# Altium project Staj.PrjPcb
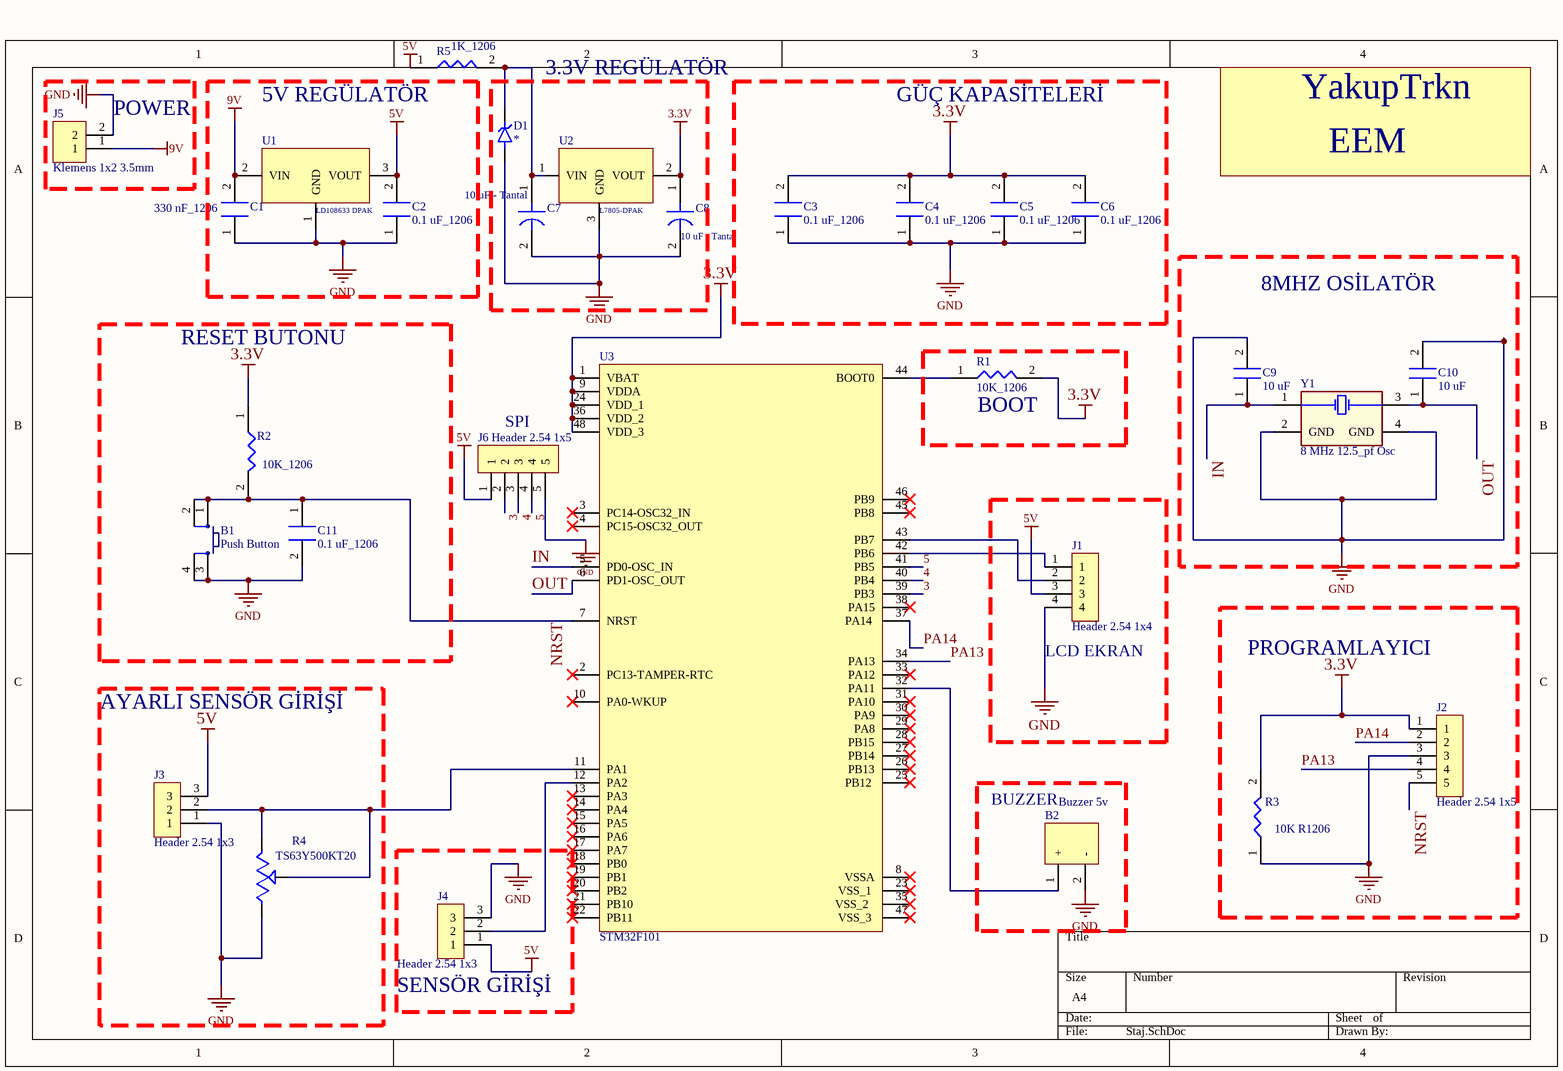
[diagram p0: Staj.SchDoc]
1 sheet, 30 parts. Net scope: global (net labels, ports and power ports of the same name join across sheets).
Board files: PCB2.PcbDoc, Staj.PcbDoc, PCB1.PcbDoc

## Sheet Staj.SchDoc
size A4

### Parts
?  (no value)
B1  Push Button  [PUSB BUTTON-SMD]
B2  Buzzer 5v  [Buzzer 5v]
C1  330 nF_1206  [C1206]
C2  0.1 uF_1206  [C1206]
C3  0.1 uF_1206  [C1206]
C4  0.1 uF_1206  [C1206]
C5  0.1 uF_1206  [C1206]
C6  0.1 uF_1206  [C1206]
C7  10 uF - Tantal  [C1206- TANTAL]
C8  10 uF - Tantal  [C1206- TANTAL]
C9  10 uF  [C1206]
C10  10 uF  [C1206]
C11  0.1 uF_1206  [C1206]
D1  *  [DIOM5436X247N]
J1  Header 2.54 1x4  [Header 2.54 1x4]
J2  Header 2.54 1x5  [Header 2.54 1x5]
J3  Header 2.54 1x3  [Header 2.54 1x3]
J4  Header 2.54 1x3  [Header 2.54 1x3]
J5  Klemens 1x2 3.5mm  [Klemens 1x2 - 3.5mm]
J6  Header 2.54 1x5  [Header 2.54 1x5]
R1  10K_1206  [R1206 Resıstor]
R2  10K_1206  [R1206 Resıstor]
R3  10K R1206  [R1206 Resıstor]
R4  TS63Y500KT20  [TRIM_TS63Y500KT20]
R5  1K_1206  [R1206 Resıstor]
U1  LD108633 DPAK  [DPAK228P972X230-3N]
U2  L7805-DPAK  [DPAK228P972X230-3N]
U3  STM32F101  [LQFP48-STM]
Y1  8 MHz 12.5_pf Osc  [8 MHZ Osc.]

### Nets
3.3V: C3.2 C4.2 C5.2 C6.2 C8.1 J2.1 R1.2 R2.1 R3.2 U2.2(VOUT) U3.1(VBAT) U3.9(VDDA) U3.24(VDD_1) U3.36(VDD_2) U3.48(VDD_3)
5V: C2.2 J1.3 J3.3 J4.1 J6.1 R5.1 U1.3(VOUT)
9V: C1.2 J5.1 U1.2(VIN)
GND: B1.3 B1.4 B2.2(-) C1.1 C2.1 C3.1 C4.1 C5.1 C6.1 C7.2 C8.2 C9.2 C10.2 C11.2 D1.A J1.4 J2.3 J3.1 J4.3 J5.2 J6.5 R3.1 R4.1(A) U1.1(GND) U2.3(GND) Y1.2(GND) Y1.4(GND)
3: J6.2 U3.39(PB3)
4: J6.3 U3.40(PB4)
5: J6.4 U3.41(PB5)
IN: C9.1 U3.5(PD0-OSC_IN) Y1.1
NRST: B1.1 B1.2 C11.1 J2.5 R2.2 U3.7(NRST)
OUT: C10.1 U3.6(PD1-OSC_OUT) Y1.3
PA13: J2.4 U3.34(PA13)
PA14: J2.2 U3.37(PA14)
NetB2_1: B2.1(+) U3.32(PA11)
NetC7_1: C7.1 D1.C(K) R5.2 U2.1(VIN)
NetJ1_1: J1.1 U3.42(PB6)
NetJ1_2: J1.2 U3.43(PB7)
NetJ3_2: J3.2 R4.2(B) R4.3(C) U3.11(PA1)
NetJ4_2: J4.2 U3.12(PA2)
NetR1_1: R1.1 U3.44(BOOT0)

Not connected (* = marked no-connect by the designer): U3 2(PC13-TAMPER-RTC)* 3(PC14-OSC32_IN)* 4(PC15-OSC32_OUT)* 8(VSSA)* 10(PA0-WKUP)* 13(PA3)* 14(PA4)* 15(PA5)* 16(PA6)* 17(PA7)* 18(PB0)* 19(PB1)* 20(PB2)* 21(PB10)* 22(PB11)* 23(VSS_1_)* 25(PB12_)* 26(PB13)* 27(PB14)* 28(PB15)* 29(PA8)* 30(PA9)* 31(PA10)* 33(PA12)* 35(VSS_2__)* 38(PA15)* 45(PB8)* 46(PB9)* 47(VSS_3_)*

### Notes on the sheet
- 3.3V REGÜLATÖR
- (near J5) POWER
- 5V REGÜLATÖR
- GÜÇ KAPASİTELERİ
- YakupTrkn
- EEM
- RESET BUTONU
- 8MHZ OSİLATÖR
- (near R1) BOOT
- (near J6) SPI
- (near J1) LCD EKRAN
- PROGRAMLAYICI
- AYARLI SENSÖR GİRİŞİ
- BUZZER
- (near J4) SENSÖR GİRİŞİ

### Library data of the parts
? = Component_1
B1 = Push Button: Smd Push Button; Satın Alma Linki: https://urun.n11.com/diger/mini-pushbutton-switch-smd-P227461537?gclid=Cj0KCQjwkoDmBRCcARIsAG3xzl8Y_-jeD7HocNM6lvuZ_rVp83568XPGtNzlPwXWLph8oCRqo0yh87UaApZYEALw_wcB&gclsrc=aw.ds
C1 = 330 nF C1206
C2-C6 C11 = 0.1 uF C1206
D1 = S1Z1SMB5919BT3G: Zener Diode 5.6V 3W Â±5% Surface Mount SMB; MF: {'manufacturer': u'ON Semiconductor'}; Availability: Unavailable; MP: S1Z1SMB5919BT3G; Value: *; Package: None; Price: None
R1 R2 = 10K R1206
R4 = TS63Y500KT20: MF: {'manufacturer': u'Vishay Dale'}; Availability: Unavailable; Price: None; MP: TS63Y500KT20; Package: None; Value: *
R5 = 1K R1206
U1 = LD108633 DPAK: LD1086 3.3V REGULATOR
U2 = L7805-DPAK: L7805 5V REGULATOR. SMD PAKET
U3 = STM32F101: STM32F101 48 PİNLİ MİKROİŞLEMCİ
Y1 = 8 MHz 12.5 pf Osc